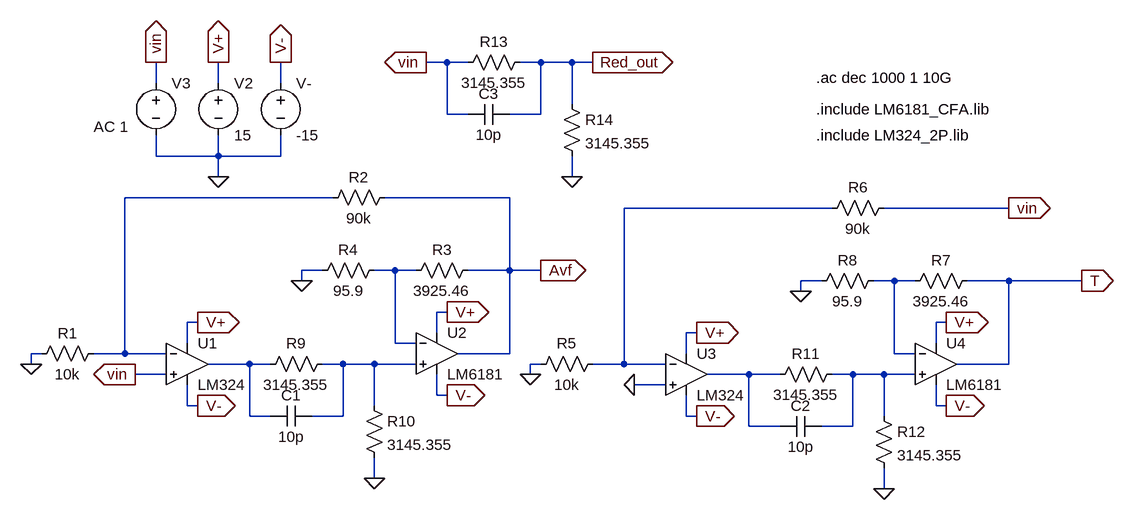
[diagram p0: schematic TP3_C3.asc]
TP3_C3.asc, the LTspice schematic file:
Version 4.1
SHEET 1 2080 760
WIRE 544 -272 512 -272
WIRE 576 -272 544 -272
WIRE 688 -272 656 -272
WIRE 736 -272 688 -272
WIRE 768 -272 736 -272
WIRE 96 -240 96 -272
WIRE 192 -240 192 -272
WIRE 288 -240 288 -272
WIRE 736 -208 736 -272
WIRE 544 -192 544 -272
WIRE 576 -192 544 -192
WIRE 688 -192 688 -272
WIRE 688 -192 640 -192
WIRE 96 -128 96 -160
WIRE 192 -128 192 -160
WIRE 192 -128 96 -128
WIRE 288 -128 288 -160
WIRE 288 -128 192 -128
WIRE 192 -96 192 -128
WIRE 736 -96 736 -128
WIRE 368 -64 48 -64
WIRE 640 -64 448 -64
WIRE 1136 -48 816 -48
WIRE 1408 -48 1216 -48
WIRE 352 48 320 48
WIRE 464 48 432 48
WIRE 496 48 464 48
WIRE 640 48 640 -64
WIRE 640 48 576 48
WIRE 688 48 640 48
WIRE 320 64 320 48
WIRE 1120 64 1088 64
WIRE 1232 64 1200 64
WIRE 1264 64 1232 64
WIRE 1408 64 1344 64
WIRE 1520 64 1408 64
WIRE 1088 80 1088 64
WIRE 544 112 528 112
WIRE 160 128 144 128
WIRE 1312 128 1296 128
WIRE 528 144 528 112
WIRE 928 144 912 144
WIRE 144 160 144 128
WIRE 464 160 464 48
WIRE 496 160 464 160
WIRE 1296 160 1296 128
WIRE -80 176 -96 176
WIRE 48 176 48 -64
WIRE 48 176 0 176
WIRE 112 176 48 176
WIRE 640 176 640 48
WIRE 640 176 560 176
WIRE 912 176 912 144
WIRE 1232 176 1232 64
WIRE 1264 176 1232 176
WIRE -96 192 -96 176
WIRE 240 192 176 192
WIRE 272 192 240 192
WIRE 384 192 352 192
WIRE 432 192 384 192
WIRE 496 192 432 192
WIRE 688 192 672 192
WIRE 816 192 816 -48
WIRE 816 192 768 192
WIRE 880 192 816 192
WIRE 1408 192 1408 64
WIRE 1408 192 1328 192
WIRE 112 208 64 208
WIRE 672 208 672 192
WIRE 1008 208 944 208
WIRE 1056 208 1008 208
WIRE 1168 208 1136 208
WIRE 1216 208 1168 208
WIRE 1264 208 1216 208
WIRE 880 224 832 224
WIRE 528 240 528 208
WIRE 544 240 528 240
WIRE 144 256 144 224
WIRE 160 256 144 256
WIRE 432 256 432 192
WIRE 1296 256 1296 224
WIRE 1312 256 1296 256
WIRE 240 272 240 192
WIRE 272 272 240 272
WIRE 384 272 384 192
WIRE 384 272 336 272
WIRE 912 272 912 240
WIRE 928 272 912 272
WIRE 1216 272 1216 208
WIRE 1008 288 1008 208
WIRE 1056 288 1008 288
WIRE 1168 288 1168 208
WIRE 1168 288 1120 288
WIRE 432 368 432 336
WIRE 1216 384 1216 352
FLAG -96 192 0
FLAG 320 64 0
FLAG 688 48 Avf
IOPIN 688 48 Out
FLAG 288 -272 V-
IOPIN 288 -272 Out
FLAG 192 -272 V+
IOPIN 192 -272 Out
FLAG 96 -272 vin
IOPIN 96 -272 Out
FLAG 192 -96 0
FLAG 160 256 V-
IOPIN 160 256 Out
FLAG 544 240 V-
IOPIN 544 240 Out
FLAG 160 128 V+
IOPIN 160 128 Out
FLAG 544 112 V+
IOPIN 544 112 Out
FLAG 64 208 vin
IOPIN 64 208 Out
FLAG 672 208 0
FLAG 1088 80 0
FLAG 1520 64 T
IOPIN 1520 64 Out
FLAG 928 272 V-
IOPIN 928 272 Out
FLAG 1312 256 V-
IOPIN 1312 256 Out
FLAG 928 144 V+
IOPIN 928 144 Out
FLAG 1312 128 V+
IOPIN 1312 128 Out
FLAG 832 224 0
FLAG 1408 -48 vin
IOPIN 1408 -48 Out
FLAG 432 368 0
FLAG 1216 384 0
FLAG 736 -96 0
FLAG 512 -272 vin
IOPIN 512 -272 Out
FLAG 768 -272 Red_out
IOPIN 768 -272 Out
SYMBOL OpAmps\\opamp2 144 128 R0
SYMATTR InstName U1
SYMATTR Value LM324
SYMBOL OpAmps\\opamp2 528 112 R0
SYMATTR InstName U2
SYMATTR Value LM6181
SYMBOL res 16 160 R90
WINDOW 0 0 56 VBottom 2
WINDOW 3 32 56 VTop 2
SYMATTR InstName R1
SYMATTR Value 10k
SYMBOL res 464 -80 R90
WINDOW 0 0 56 VBottom 2
WINDOW 3 32 56 VTop 2
SYMATTR InstName R2
SYMATTR Value 90k
SYMBOL res 592 32 R90
WINDOW 0 0 56 VBottom 2
WINDOW 3 32 56 VTop 2
SYMATTR InstName R3
SYMATTR Value 3925.46
SYMBOL res 448 32 R90
WINDOW 0 0 56 VBottom 2
WINDOW 3 32 56 VTop 2
SYMATTR InstName R4
SYMATTR Value 95.9
SYMBOL voltage 288 -256 R0
WINDOW 123 0 0 Left 0
WINDOW 39 0 0 Left 0
SYMATTR InstName V-
SYMATTR Value -15
SYMBOL voltage 192 -256 R0
WINDOW 123 0 0 Left 0
WINDOW 39 0 0 Left 0
SYMATTR InstName V2
SYMATTR Value 15
SYMBOL voltage 96 -256 R0
WINDOW 3 -43 170 Left 2
WINDOW 123 -96 83 Left 2
WINDOW 39 0 0 Left 0
SYMATTR InstName V3
SYMATTR Value ""
SYMATTR Value2 AC 1
SYMBOL OpAmps\\opamp2 912 144 R0
SYMATTR InstName U3
SYMATTR Value LM324
SYMBOL OpAmps\\opamp2 1296 128 R0
SYMATTR InstName U4
SYMATTR Value LM6181
SYMBOL res 784 176 R90
WINDOW 0 0 56 VBottom 2
WINDOW 3 32 56 VTop 2
SYMATTR InstName R5
SYMATTR Value 10k
SYMBOL res 1232 -64 R90
WINDOW 0 0 56 VBottom 2
WINDOW 3 32 56 VTop 2
SYMATTR InstName R6
SYMATTR Value 90k
SYMBOL res 1360 48 R90
WINDOW 0 0 56 VBottom 2
WINDOW 3 32 56 VTop 2
SYMATTR InstName R7
SYMATTR Value 3925.46
SYMBOL res 1216 48 R90
WINDOW 0 0 56 VBottom 2
WINDOW 3 32 56 VTop 2
SYMATTR InstName R8
SYMATTR Value 95.9
SYMBOL res 368 176 R90
WINDOW 0 0 56 VBottom 2
WINDOW 3 32 56 VTop 2
SYMATTR InstName R9
SYMATTR Value 3145.355
SYMBOL cap 336 256 R90
WINDOW 0 0 32 VBottom 2
WINDOW 3 32 32 VTop 2
SYMATTR InstName C1
SYMATTR Value 10p
SYMBOL res 416 240 R0
SYMATTR InstName R10
SYMATTR Value 3145.355
SYMBOL res 1152 192 R90
WINDOW 0 0 56 VBottom 2
WINDOW 3 32 56 VTop 2
SYMATTR InstName R11
SYMATTR Value 3145.355
SYMBOL cap 1120 272 R90
WINDOW 0 0 32 VBottom 2
WINDOW 3 32 32 VTop 2
SYMATTR InstName C2
SYMATTR Value 10p
SYMBOL res 1200 256 R0
SYMATTR InstName R12
SYMATTR Value 3145.355
SYMBOL res 672 -288 R90
WINDOW 0 0 56 VBottom 2
WINDOW 3 32 56 VTop 2
SYMATTR InstName R13
SYMATTR Value 3145.355
SYMBOL cap 640 -208 R90
WINDOW 0 0 32 VBottom 2
WINDOW 3 32 32 VTop 2
SYMATTR InstName C3
SYMATTR Value 10p
SYMBOL res 720 -224 R0
SYMATTR InstName R14
SYMATTR Value 3145.355
TEXT 1112 -160 Left 2 !.include LM324_2P.lib
TEXT 1112 -200 Left 2 !.include LM6181_CFA.lib
TEXT 1112 -248 Left 2 !.ac dec 1000 1 10G

The netlist it stands for:
* TP3_C3.asc
X§U1 vin N001 V+ V- N005 LM324  ; pins In+ In- V+ V- OUT
X§U2 N006 N003 V+ V- Avf LM6181  ; pins In+ In- V+ V- OUT
R1 N001 0 10k
R2 Avf N001 90k
R3 Avf N003 3925.46
R4 N003 0 95.9
V- V- 0 -15
V2 V+ 0 15
V3 vin 0 AC 1
X§U3 0 N002 V+ V- N007 LM324  ; pins In+ In- V+ V- OUT
X§U4 N008 N004 V+ V- T LM6181  ; pins In+ In- V+ V- OUT
R5 N002 0 10k
R6 vin N002 90k
R7 T N004 3925.46
R8 N004 0 95.9
R9 N006 N005 3145.355
C1 N006 N005 10p
R10 N006 0 3145.355
R11 N008 N007 3145.355
C2 N008 N007 10p
R12 N008 0 3145.355
R13 Red_out vin 3145.355
C3 Red_out vin 10p
R14 Red_out 0 3145.355
.include LM324_2P.lib
.include LM6181_CFA.lib
.ac dec 1000 1 10G
.backanno
.end

* Results of the author's LTspice run, read from the files saved beside the schematic
* Operating Point, zero values left out:
*   V(v+) = 15 V
*   V(v-) = -15 V
*   I(V-) = 60 nA
*   I(V2) = -60 nA
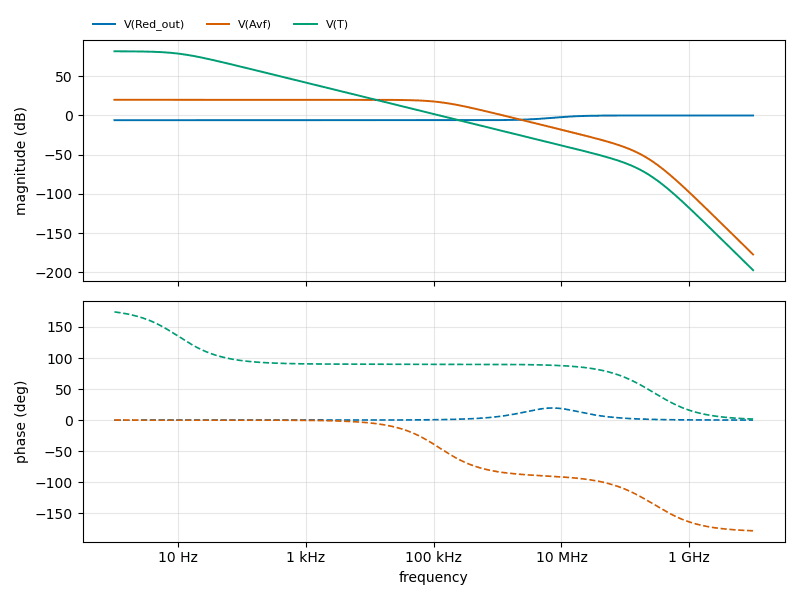
[diagram p1: AC Analysis of TP3_C3.asc, plotted from the saved traces]
* AC Analysis, 1 run:
*   V(Red_out): -6.02 dB at 1 Hz, -0.00 dB at 10 GHz, peak -0.00 dB at 10 GHz, 3 dB below the peak at 7.156 MHz
*   V(Avf): 20.00 dB at 1 Hz, -177.19 dB at 10 GHz, peak 20.00 dB at 1.009 Hz, 3 dB below the peak at 124.1 kHz
*   V(T): 81.82 dB at 1 Hz, -197.19 dB at 10 GHz, peak 81.82 dB at 1 Hz, 3 dB below the peak at 10.11 Hz